# Altium project 1200.PrjPcb
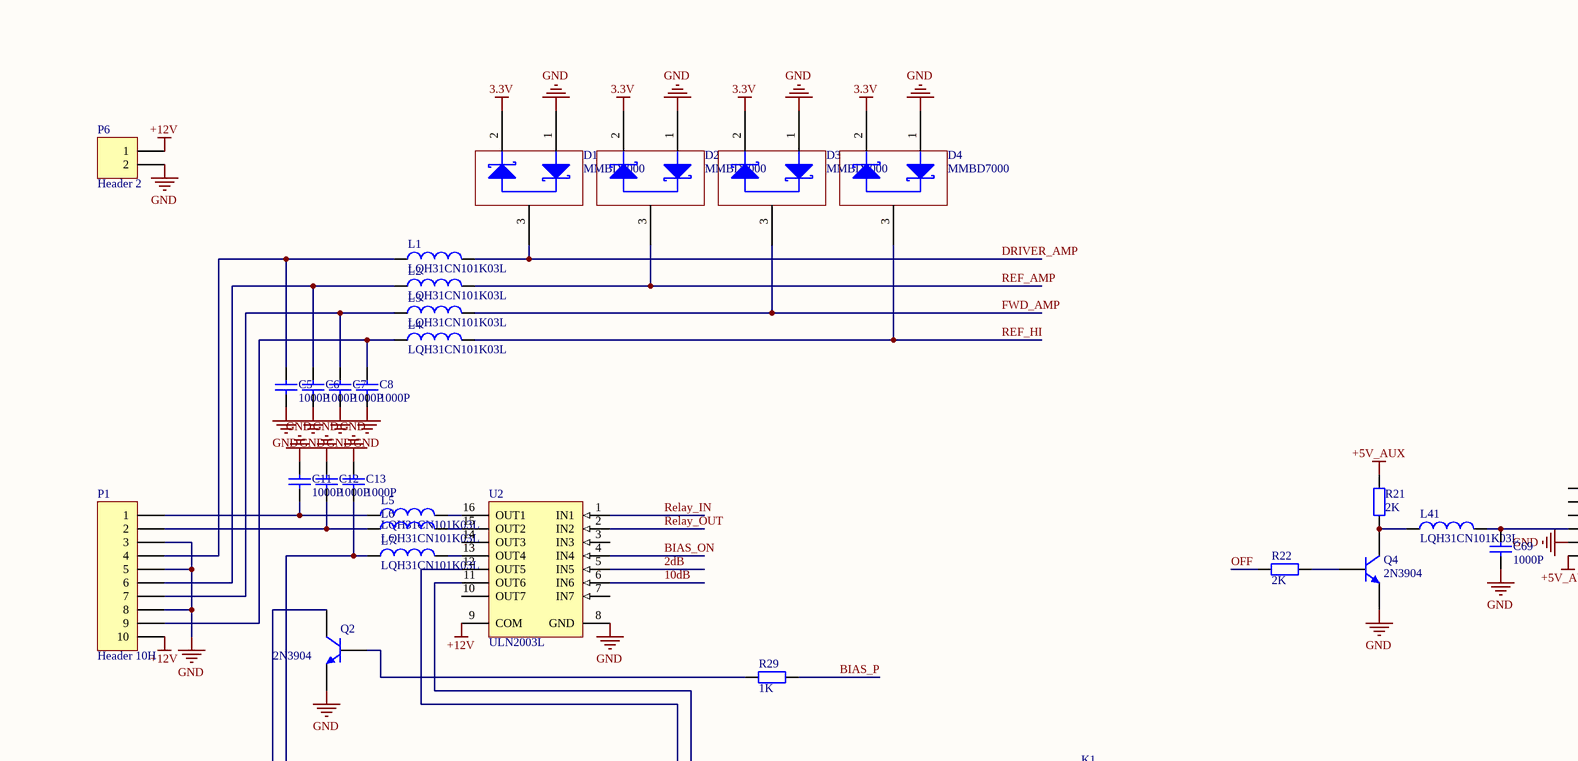
[diagram p0: 1200_cpu.SchDoc, top left]
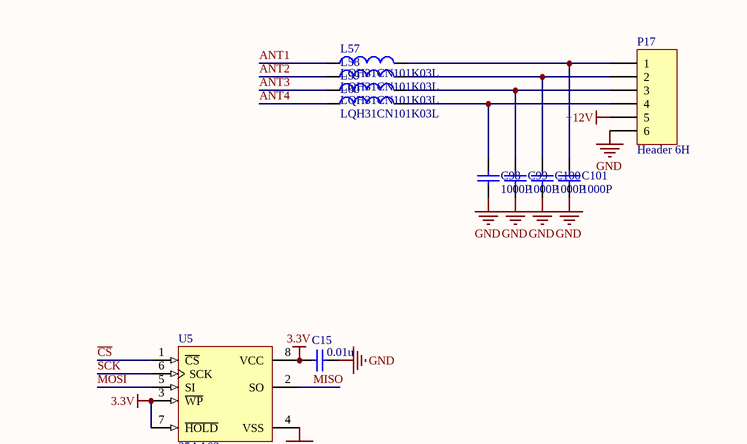
[diagram p1: 1200_cpu.SchDoc, top right]
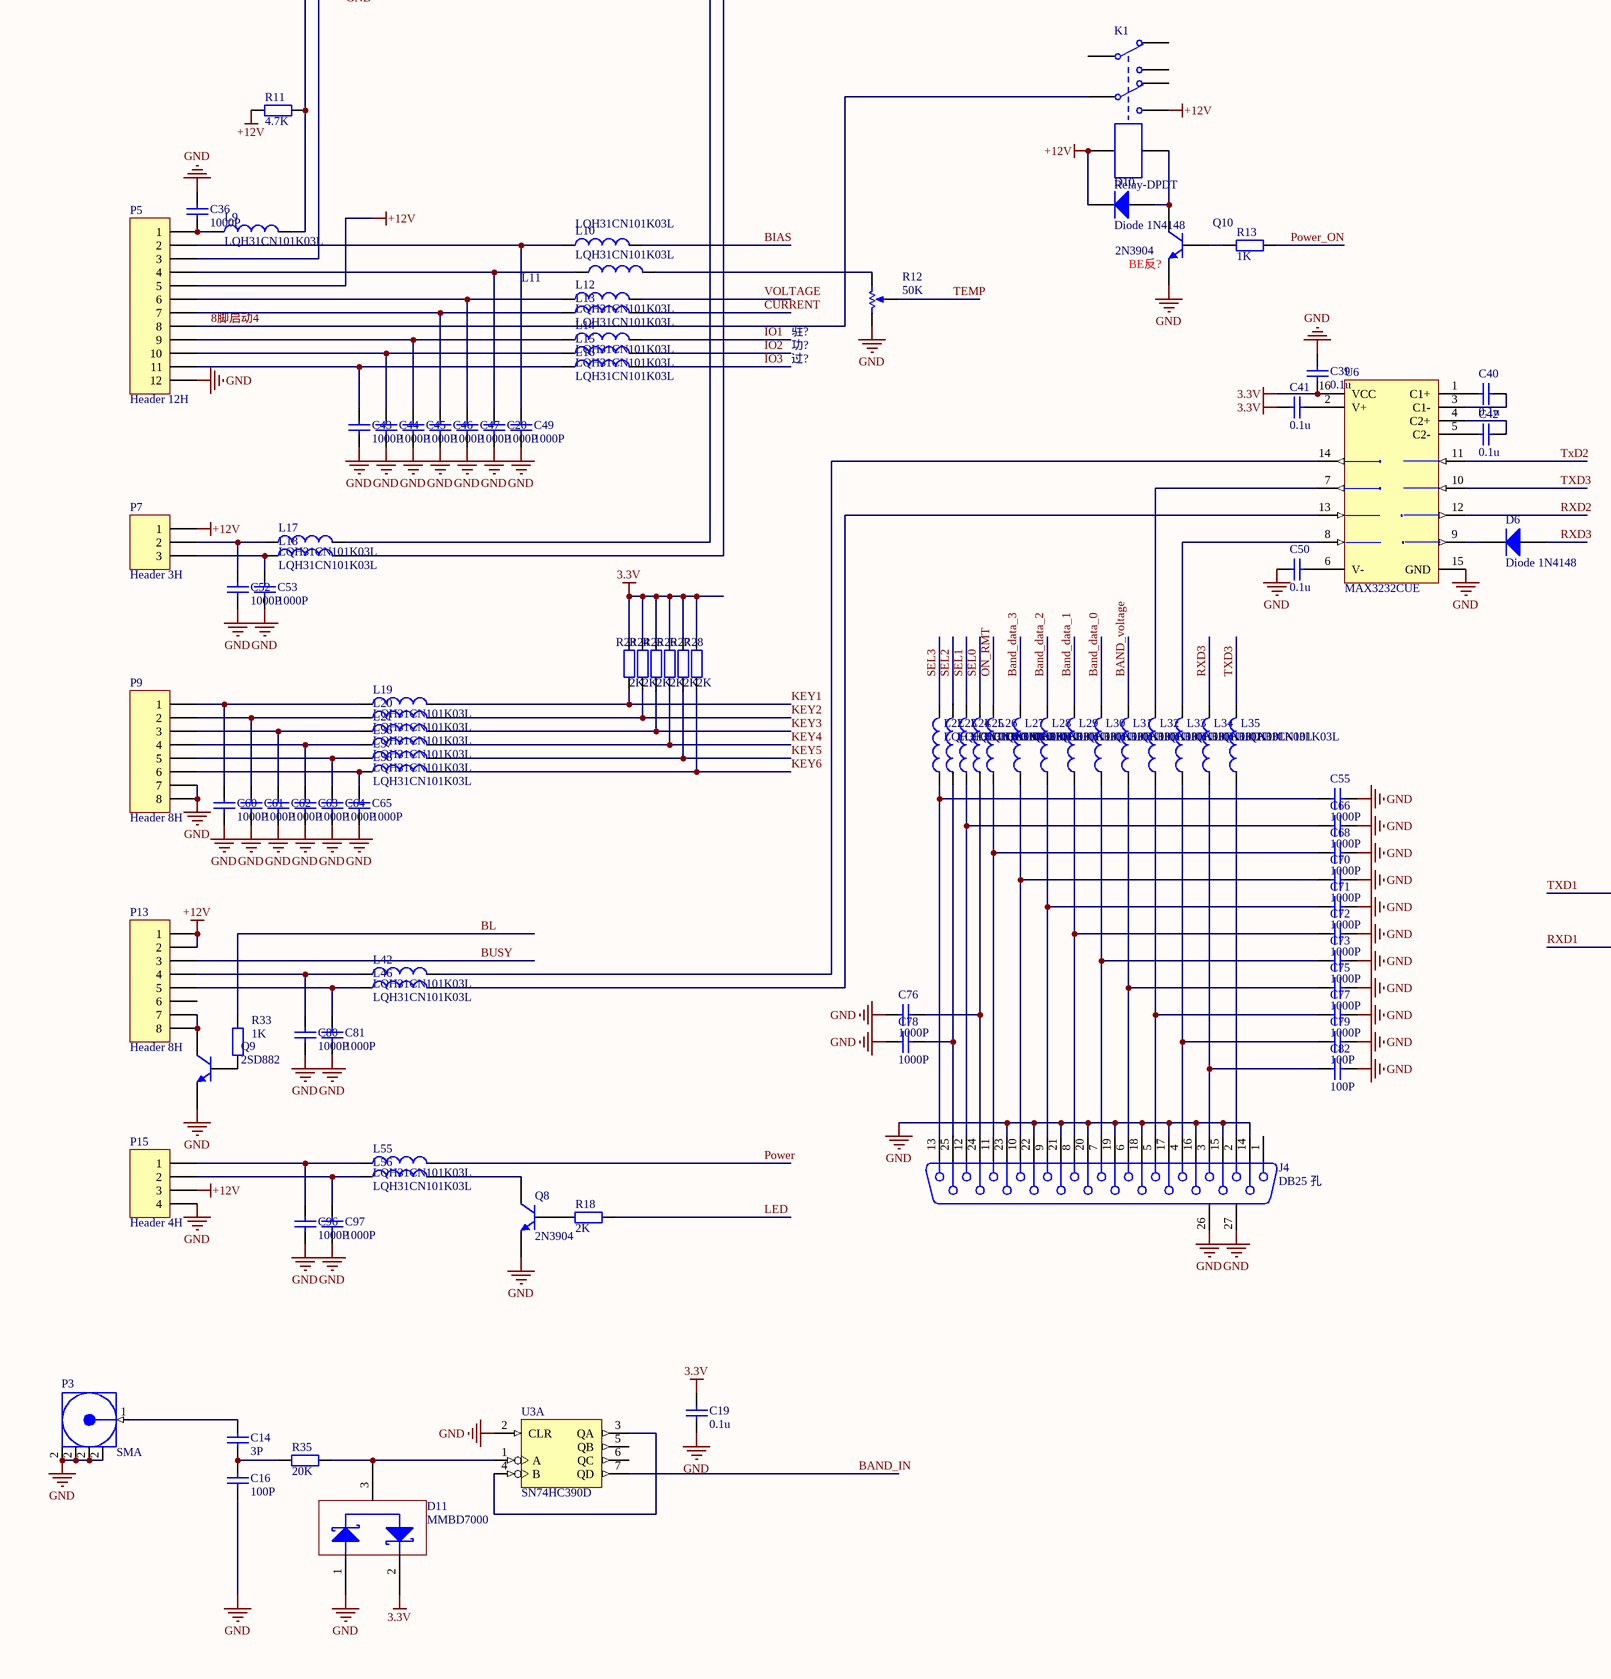
[diagram p2: 1200_cpu.SchDoc, bottom left]
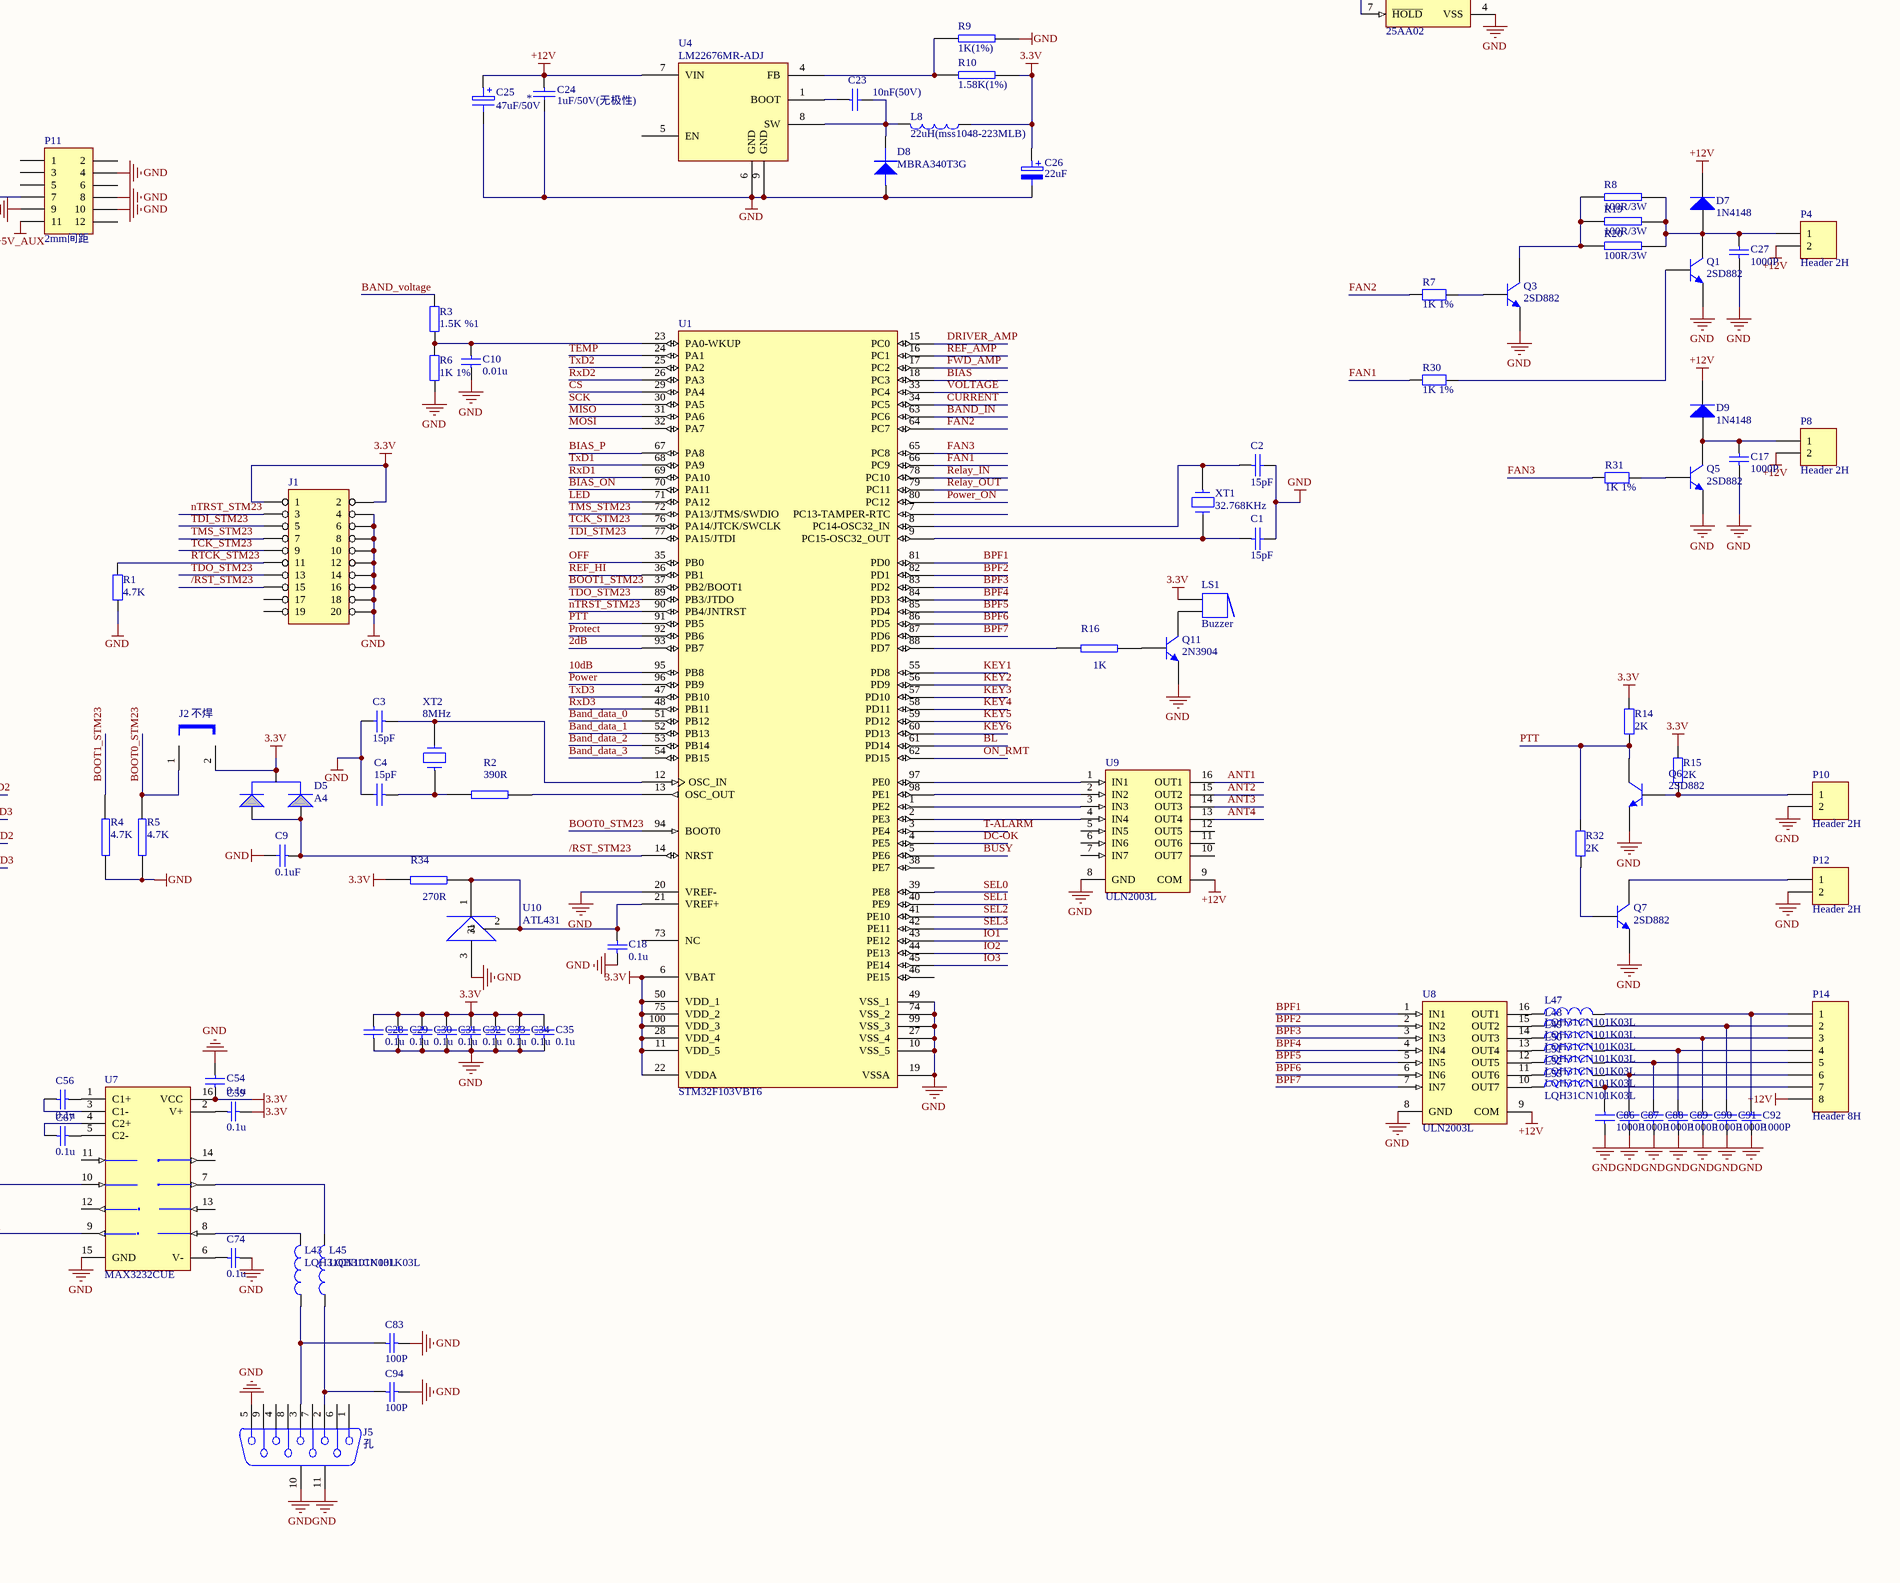
[diagram p3: 1200_cpu.SchDoc, bottom right]
1 sheet, 234 parts. Net scope: global (net labels, ports and power ports of the same name join across sheets).
Board file: 1200_cpu.PcbDoc

## Sheet 1200_cpu.SchDoc
size A1

### Parts
C1  15pF  [C0805-3D]
C2  15pF  [C0805-3D]
C3  15pF  [C0805-3D]
C4  15pF  [C0805-3D]
C5  1000P  [C0805-3D]
C6  1000P  [C0805-3D]
C7  1000P  [C0805-3D]
C8  1000P  [C0805-3D]
C9  0.1uF  [C0805-3D]
C10  0.01u  [C0805-3D]
C11  1000P  [C0805-3D]
C12  1000P  [C0805-3D]
C13  1000P  [C0805-3D]
C14  3P  [C0805-3D]
C15  0.01u  [C0805-3D]
C16  100P  [C0805-3D]
C17  1000P  [C0805-3D]
C18  0.1u  [C0805-3D]
C19  0.1u  [C0805-3D]
C20  1000P  [C0805-3D]
C23  10nF(50V)  [C0805-3D]
C24  *  C: 1uF/50V(无极性)  [1206C]
C25  47uF/50V  [1206c]
C26  22uF  [1206C]
C27  1000P  [C0805-3D]
C28  0.1u  [C0805-3D]
C29  0.1u  [C0805-3D]
C30  0.1u  [C0805-3D]
C31  0.1u  [C0805-3D]
C32  0.1u  [C0805-3D]
C33  0.1u  [C0805-3D]
C34  0.1u  [C0805-3D]
C35  0.1u  [C0805-3D]
C36  1000P  [C0805-3D]
C39  0.1u  [C0805-3D]
C40  0.1u  [C0805-3D]
C41  0.1u  [C0805-3D]
C42  0.1u  [C0805-3D]
C43  1000P  [C0805-3D]
C44  1000P  [C0805-3D]
C45  1000P  [C0805-3D]
C46  1000P  [C0805-3D]
C47  1000P  [C0805-3D]
C49  1000P  [C0805-3D]
C50  0.1u  [C0805-3D]
C52  1000P  [C0805-3D]
C53  1000P  [C0805-3D]
C54  0.1u  [C0805-3D]
C55  1000P  [C0805-3D]
C56  0.1u  [C0805-3D]
C59  0.1u  [C0805-3D]
C60  1000P  [C0805-3D]
C61  1000P  [C0805-3D]
C62  1000P  [C0805-3D]
C63  1000P  [C0805-3D]
C64  1000P  [C0805-3D]
C65  1000P  [C0805-3D]
C66  1000P  [C0805-3D]
C67  0.1u  [C0805-3D]
C68  1000P  [C0805-3D]
C69  1000P  [C0805-3D]
C70  1000P  [C0805-3D]
C71  1000P  [C0805-3D]
C72  1000P  [C0805-3D]
C73  1000P  [C0805-3D]
C74  0.1u  [C0805-3D]
C75  1000P  [C0805-3D]
C76  1000P  [C0805-3D]
C77  1000P  [C0805-3D]
C78  1000P  [C0805-3D]
C79  100P  [C0805-3D]
C80  1000P  [C0805-3D]
C81  1000P  [C0805-3D]
C82  100P  [C0805-3D]
C83  100P  [C0805-3D]
C86  1000P  [C0805-3D]
C87  1000P  [C0805-3D]
C88  1000P  [C0805-3D]
C89  1000P  [C0805-3D]
C90  1000P  [C0805-3D]
C91  1000P  [C0805-3D]
C92  1000P  [C0805-3D]
C94  100P  [C0805-3D]
C96  1000P  [C0805-3D]
C97  1000P  [C0805-3D]
C98  1000P  [C0805-3D]
C99  1000P  [C0805-3D]
C100  1000P  [C0805-3D]
C101  1000P  [C0805-3D]
D1  MMBD7000  [sot-23]
D2  MMBD7000  [sot-23]
D3  MMBD7000  [sot-23]
D4  MMBD7000  [sot-23]
D5  A4  [SOT23]
D6  Diode 1N4148  [do-35]
D7  1N4148  [DO-35]
D8  MBRA340T3G  [1206d]
D9  1N4148  [DO-35]
D10  Diode 1N4148  [do-35]
D11  MMBD7000  [sot-23]
J1  (no value)  [idc20]
J2  不焊  [SIP2]
J4  DB25 孔  [DB25-V]
J5  孔  [DB9-V]
K1  Relay-DPDT  [115f-2z]
L1  LQH31CN101K03L  [1206]
L2  LQH31CN101K03L  [1206]
L3  LQH31CN101K03L  [1206]
L4  LQH31CN101K03L  [1206]
L5  LQH31CN101K03L  [1206]
L6  LQH31CN101K03L  [1206]
L7  LQH31CN101K03L  [1206]
L8  22uH(mss1048-223MLB)  [IND_SMD_10X10]
L9  LQH31CN101K03L  [1206]
L10  LQH31CN101K03L  [1206]
L11  LQH31CN101K03L  [1206]
L12  LQH31CN101K03L  [1206]
L13  LQH31CN101K03L  [1206]
L14  LQH31CN101K03L  [1206]
L15  LQH31CN101K03L  [1206]
L16  LQH31CN101K03L  [1206]
L17  LQH31CN101K03L  [1206]
L18  LQH31CN101K03L  [1206]
L19  LQH31CN101K03L  [1206]
L20  LQH31CN101K03L  [1206]
L21  LQH31CN101K03L  [1206]
L22  LQH31CN101K03L  [1206]
L23  LQH31CN101K03L  [1206]
L24  LQH31CN101K03L  [1206]
L25  LQH31CN101K03L  [1206]
L26  LQH31CN101K03L  [1206]
L27  LQH31CN101K03L  [1206]
L28  LQH31CN101K03L  [1206]
L29  LQH31CN101K03L  [1206]
L30  LQH31CN101K03L  [1206]
L31  LQH31CN101K03L  [1206]
L32  LQH31CN101K03L  [1206]
L33  LQH31CN101K03L  [1206]
L34  LQH31CN101K03L  [1206]
L35  LQH31CN101K03L  [1206]
L36  LQH31CN101K03L  [1206]
L37  LQH31CN101K03L  [1206]
L38  LQH31CN101K03L  [1206]
L41  LQH31CN101K03L  [1206]
L42  LQH31CN101K03L  [1206]
L43  LQH31CN101K03L  [1206]
L45  LQH31CN101K03L  [1206]
L46  LQH31CN101K03L  [1206]
L47  LQH31CN101K03L  [1206]
L48  LQH31CN101K03L  [1206]
L49  LQH31CN101K03L  [1206]
L50  LQH31CN101K03L  [1206]
L51  LQH31CN101K03L  [1206]
L52  LQH31CN101K03L  [1206]
L53  LQH31CN101K03L  [1206]
L55  LQH31CN101K03L  [1206]
L56  LQH31CN101K03L  [1206]
L57  LQH31CN101K03L  [1206]
L58  LQH31CN101K03L  [1206]
L59  LQH31CN101K03L  [1206]
L60  LQH31CN101K03L  [1206]
LS1  Buzzer  [BEEP]
P1  Header 10H  [2510-10]
P3  SMA  [sma]
P4  Header 2H  [2510-2]
P5  Header 12H  [2510-12]
P6  Header 2  [3.96-2]
P7  Header 3H  [2510-3]
P8  Header 2H  [2510-2]
P9  Header 8H  [2510-8]
P10  Header 2H  [2510-2]
P11  2mm间距  [2x6(2mm)]
P12  Header 2H  [2510-2]
P13  Header 8H  [2510-8]
P14  Header 8H  [2510-8]
P15  Header 4H  [2510-4]
P17  Header 6H  [2510-6]
Q1  2SD882  [TO229P1010X238-3N]
Q2  2N3904  [sot-23]
Q3  2SD882  [TO229P1010X238-3N]
Q4  2N3904  [sot-23]
Q5  2SD882  [TO229P1010X238-3N]
Q6  2SD882  [TO229P1010X238-3N]
Q7  2SD882  [TO229P1010X238-3N]
Q8  2N3904  [sot-23]
Q9  2SD882  [TO229P1010X238-3N]
Q10  2N3904  [sot-23]
Q11  2N3904  [sot-23]
R1  4.7K  [R0805-P3D]
R2  390R  [R0805-P3D]
R3  1.5K %1  [R0805-P3D]
R4  4.7K  [R0805-P3D]
R5  4.7K  [R0805-P3D]
R6  1K 1%  [R0805-P3D]
R7  1K 1%  [R0805-P3D]
R8  100R/3W  [axial0.8]
R9  1K(1%)  [R0805-P3D]
R10  1.58K(1%)  [R0805-P3D]
R11  4.7K  [R0805-P3D]
R12  50K  [3296]
R13  1K  [R0805-P3D]
R14  2K  [R0805-P3D]
R15  2K  [R0805-P3D]
R16  1K  [R0805-P3D]
R18  2K  [R0805-P3D]
R19  100R/3W  [axial0.8]
R20  100R/3W  [axial0.8]
R21  2K  [R0805-P3D]
R22  2K  [R0805-P3D]
R23  2K  [R0805-P3D]
R24  2K  [R0805-P3D]
R25  2K  [R0805-P3D]
R26  2K  [R0805-P3D]
R27  2K  [R0805-P3D]
R28  2K  [R0805-P3D]
R29  1K  [R0805-P3D]
R30  1K 1%  [R0805-P3D]
R31  1K 1%  [R0805-P3D]
R32  2K  [R0805-P3D]
R33  1K  [R0805-P3D]
R34  270R  [R0805-P3D]
R35  20K  [R0805-P3D]
U1  STM32F103VBT6  [LQFP100_N]
U2  ULN2003L  [SO-16]
U3  SN74HC390D  [D016_N]  (part A of 2)
U4  LM22676MR-ADJ  [PSOP-8]
U5  25AA02  [SOP-8]
U6  MAX3232CUE  [so-16]
U7  MAX3232CUE  [so-16]
U8  ULN2003L  [SO-16]
U9  ULN2003L  [SO-16]
U10  ATL431  [sot23]
XT1  32.768KHz  [XTAL3]
XT2  8MHz  [XTAL]

### Nets
3.3V: C15.1 C19.1 C26.1 C28.1 C29.1 C30.1 C31.1 C32.1 C33.1 C34.1 C35.1 C39.2 C41.2 C54.2 C59.2 D1.2 D2.2 D3.2 D4.2 D5.2(K) D11.2 J1.1 J1.2 J2.2 L8.1 LS1.1 R10.1 R14.2 R15.2 R23.2 R24.2 R25.2 R26.2 R27.2 R28.2 R34.1 U1.6(VBAT) U1.11(VDD_5) U1.22(VDDA) U1.28(VDD_4) U1.50(VDD_1) U1.75(VDD_2) U1.100(VDD_3) U5.3(~{WP}) U5.7(~{HOLD}) U5.8(VCC) U6.16(VCC) U7.16(VCC)
+5V_AUX: P11.11 R21.1
+12V: C24.1 C25.1 D7.2(K) D9.2(K) D10.2(K) K1.6 K1.7 P1.10 P4.2 P5.5 P6.1 P7.1 P8.2 P13.1 P13.2 P14.8 P15.3 P17.5 R11.1 U2.9(COM) U4.7(VIN) U8.9(COM) U9.9(COM)
GND: C1.2 C2.2 C3.2 C4.2 C5.1 C6.1 C7.1 C8.1 C9.2 C10.2 C11.2 C12.2 C13.2 C15.2 C16.2 C17.1 C18.2 C19.2 C20.1 C24.2 C25.2 C26.2 C27.1 C28.2 C29.2 C30.2 C31.2 C32.2 C33.2 C34.2 C35.2 C36.2 C39.1 C43.1 C44.1 C45.1 C46.1 C47.1 C49.1 C50.1 C52.1 C53.1 C54.1 C55.1 C60.1 C61.1 C62.1 C63.1 C64.1 C65.1 C66.1 C68.1 C69.1 C70.1 C71.1 C72.1 C73.1 C74.1 C75.1 C76.2 C77.1 C78.2 C79.1 C80.1 C81.1 C82.1 C83.1 C86.1 C87.1 C88.1 C89.1 C90.1 C91.1 C92.1 C94.1 C96.1 C97.1 C98.1 C99.1 C100.1 C101.1 D1.1 D2.1 D3.1 D4.1 D8.A D11.1 J1.4 J1.6 J1.8 J1.10 J1.12 J1.14 J1.16 J1.18 J1.20 J4.14 J4.15 J4.16 J4.17 J4.18 J4.19 J4.20 J4.21 J4.22 J4.23 J4.26(MH1) J4.27(MH2) J5.5 J5.10(MH1) J5.11(MH2) P1.3 P1.5 P1.8 P3.2(GND) P5.12 P6.2 P9.7 P9.8 P10.2 P11.4 P11.8 P11.9 P11.10 P12.2 P15.4 P17.6 Q1.3(E) Q2.2(E) Q3.3(E) Q4.2(E) Q5.3(E) Q6.3(E) Q7.3(E) Q8.2(E) Q9.3(E) Q10.2(E) Q11.2(E) R1.1 R4.2 R5.2 R6.1 R9.1 R12.2(BOT) U1.10(VSS_5) U1.19(VSSA) U1.20(VREF-) U1.27(VSS_4) U1.49(VSS_1) U1.74(VSS_2) U1.99(VSS_3) U2.8(GND) U3.2(CLR) U3.8(GND) U4.6(GND) U4.9(GND) U5.4(VSS) U6.15(GND) U7.15(GND) U8.8(GND) U9.8(GND) U10.3
VCC: U3.16(VCC)
2dB: U1.93(PB7) U2.5(IN5)
8脚启动4: K1.4 P5.8
10dB: U1.95(PB8) U2.6(IN6)
/RST_STM23: C9.1 D5.1(A1) D5.3(A2) J1.15 U1.14(NRST)
ANT1: L57.2 U9.16(OUT1)
ANT2: L58.2 U9.15(OUT2)
ANT3: L59.2 U9.14(OUT3)
ANT4: L60.2 U9.13(OUT4)
Band_data_0: L30.2 U1.51(PB12)
Band_data_1: L29.2 U1.52(PB13)
Band_data_2: L28.2 U1.53(PB14)
Band_data_3: L27.2 U1.54(PB15)
BAND_IN: U1.63(PC6) U3.7(QD)
BAND_voltage: L31.2 R3.2
BIAS: L10.2 U1.18(PC3)
BIAS_ON: U1.70(PA11) U2.4(IN4)
BIAS_P: R29.1 U1.67(PA8)
BL: R33.1 U1.61(PD14)
BOOT0_STM23: J2.1 R5.1 U1.94(BOOT0)
BOOT1_STM23: R4.1 U1.37(PB2/BOOT1)
BPF1: U1.81(PD0) U8.1(IN1)
BPF2: U1.82(PD1) U8.2(IN2)
BPF3: U1.83(PD2) U8.3(IN3)
BPF4: U1.84(PD3) U8.4(IN4)
BPF5: U1.85(PD4) U8.5(IN5)
BPF6: U1.86(PD5) U8.6(IN6)
BPF7: U1.87(PD6) U8.7(IN7)
BUSY: P13.3 U1.5(PE6)
~{CS}: U1.29(PA4) U5.1(~{CS})
CURRENT: L13.2 U1.34(PC5)
DC-OK: U1.4(PE5)
DRIVER_AMP: D1.3 L1.2 U1.15(PC0)
FAN1: R30.2 U1.66(PC9)
FAN2: R7.2 U1.64(PC7)
FAN3: R31.2 U1.65(PC8)
FWD_AMP: D3.3 L3.2 U1.17(PC2)
IO1: L14.2 U1.43(PE12)
IO2: L15.2 U1.44(PE13)
IO3: L16.2 U1.45(PE14)
KEY1: L19.2 R23.1 U1.55(PD8)
KEY2: L20.2 R24.1 U1.56(PD9)
KEY3: L21.2 R25.1 U1.57(PD10)
KEY4: L36.2 R26.1 U1.58(PD11)
KEY5: L37.2 R27.1 U1.59(PD12)
KEY6: L38.2 R28.1 U1.60(PD13)
LED: R18.2 U1.71(PA12)
MISO: U1.31(PA6) U5.2(SO)
MOSI: U1.32(PA7) U5.5(SI)
nTRST_STM23: J1.3 U1.90(PB4/JNTRST)
OFF: R22.2 U1.35(PB0)
ON_RMT: L26.2 U1.62(PD15)
Power: L55.2 U1.96(PB9)
Power_ON: R13.1 U1.80(PC12)
Protect: U1.92(PB6)
PTT: Q6.2(C) R14.1 R32.2 U1.91(PB5)
REF_AMP: D2.3 L2.2 U1.16(PC1)
REF_HI: D4.3 L4.2 U1.36(PB1)
Relay_IN: U1.78(PC10) U2.1(IN1)
Relay_OUT: U1.79(PC11) U2.2(IN2)
RTCK_STM23: J1.11 R1.2
RXD1: U1.69(PA10) U7.9(R2OUT)
RXD2: U1.26(PA3) U6.12(R1OUT)
RXD3: D6.1(A) L34.2 U1.48(PB11)
SCK: U1.30(PA5) U5.6(SCK)
SEL0: L25.2 U1.39(PE8)
SEL1: L24.2 U1.40(PE9)
SEL2: L23.2 U1.41(PE10)
SEL3: L22.2 U1.42(PE11)
T-ALARM: U1.3(PE4)
TCK_STM23: J1.9 U1.76(PA14/JTCK/SWCLK)
TDI_STM23: J1.5 U1.77(PA15/JTDI)
TDO_STM23: J1.13 U1.89(PB3/JTDO)
TEMP: R12.3(TAP) U1.24(PA1)
TMS_STM23: J1.7 U1.72(PA13/JTMS/SWDIO)
TXD1: U1.68(PA9) U7.10(T2IN)
TxD2: U1.25(PA2) U6.11(T1IN)
TXD3: L35.2 U1.47(PB10) U6.10(T2IN)
VOLTAGE: L12.2 U1.33(PC4)
NetC1_1: C1.1 U1.9(PC15-OSC32_OUT) XT1.2
NetC2_1: C2.1 U1.8(PC14-OSC32_IN) XT1.1
NetC3_1: C3.1 U1.12(OSC_IN) XT2.2
NetC4_1: C4.1 R2.1 XT2.1
NetC5_2: C5.2 L1.1 P1.4
NetC6_2: C6.2 L2.1 P1.6
NetC7_2: C7.2 L3.1 P1.7
NetC8_2: C8.2 L4.1 P1.9
NetC10_1: C10.1 R3.1 R6.2 U1.23(PA0-WKUP)
NetC11_1: C11.1 L5.1 P1.1
NetC12_1: C12.1 L6.1 P1.2
NetC13_1: C13.1 L7.1 P5.3
NetC14_1: C14.1 P3.1(Signal)
NetC14_2: C14.2 C16.1 R35.1
NetC17_2: C17.2 D9.1(A) P8.1 Q5.2(C)
NetC18_1: C18.1 R34.2 U1.21(VREF+) U10.1 U10.2
NetC20_2: C20.2 L11.1 P5.4
NetC23_1: C23.1 U4.1(BOOT)
NetC23_2: C23.2 D8.K L8.2 U4.8(SW)
NetC27_2: C27.2 D7.1(A) P4.1 Q1.2(C) R8.1 R19.1 R20.1
NetC36_1: C36.1 L9.1 P5.1
NetC40_1: C40.1 U6.3(C1-)
NetC40_2: C40.2 U6.1(C1+)
NetC41_1: C41.1 U6.2(V+)
NetC42_1: C42.1 U6.5(C2-)
NetC42_2: C42.2 U6.4(C2+)
NetC43_2: C43.2 L16.1 P5.11
NetC44_2: C44.2 L15.1 P5.10
NetC45_2: C45.2 L14.1 P5.9
NetC46_2: C46.2 L13.1 P5.7
NetC47_2: C47.2 L12.1 P5.6
NetC49_2: C49.2 L10.1 P5.2
NetC50_2: C50.2 U6.6(V-)
NetC52_2: C52.2 L17.1 P7.2
NetC53_2: C53.2 L18.1 P7.3
NetC55_2: C55.2 J4.13 L22.1
NetC56_1: C56.1 U7.3(C1-)
NetC56_2: C56.2 U7.1(C1+)
NetC59_1: C59.1 U7.2(V+)
NetC60_2: C60.2 L19.1 P9.1
NetC61_2: C61.2 L20.1 P9.2
NetC62_2: C62.2 L21.1 P9.3
NetC63_2: C63.2 L36.1 P9.4
NetC64_2: C64.2 L37.1 P9.5
NetC65_2: C65.2 L38.1 P9.6
NetC66_2: C66.2 J4.12 L24.1
NetC67_1: C67.1 U7.5(C2-)
NetC67_2: C67.2 U7.4(C2+)
NetC68_2: C68.2 J4.11 L26.1
NetC69_2: C69.2 L41.1 P11.7
NetC70_2: C70.2 J4.10 L27.1
NetC71_2: C71.2 J4.9 L28.1
NetC72_2: C72.2 J4.8 L29.1
NetC73_2: C73.2 J4.7 L30.1
NetC74_2: C74.2 U7.6(V-)
NetC75_2: C75.2 J4.6 L31.1
NetC76_1: C76.1 J4.24 L25.1
NetC77_2: C77.2 J4.5 L32.1
NetC78_1: C78.1 J4.25 L23.1
NetC79_2: C79.2 J4.4 L33.1
NetC80_2: C80.2 L42.1 P13.4
NetC81_2: C81.2 L46.1 P13.5
NetC82_2: C82.2 J4.3 L34.1
NetC83_2: C83.2 J5.3 L43.2
NetC86_2: C86.2 L53.1 P14.7
NetC87_2: C87.2 L52.1 P14.6
NetC88_2: C88.2 L51.1 P14.5
NetC89_2: C89.2 L50.1 P14.4
NetC90_2: C90.2 L49.1 P14.3
NetC91_2: C91.2 L48.1 P14.2
NetC92_2: C92.2 L47.1 P14.1
NetC94_2: C94.2 J5.2 L45.2
NetC96_2: C96.2 L55.1 P15.1
NetC97_2: C97.2 L56.1 P15.2
NetC98_2: C98.2 L60.1 P17.4
NetC99_2: C99.2 L59.1 P17.3
NetC100_2: C100.2 L58.1 P17.2
NetC101_2: C101.2 L57.1 P17.1
NetD6_2: D6.2(K) U6.9(R2OUT)
NetD10_1: D10.1(A) K1.8 Q10.3(C)
NetD11_3: D11.3 R35.2 U3.1(A)
NetJ4_2: J4.2 L35.1
NetL5_2: L5.2 U2.16(OUT1)
NetL6_2: L6.2 U2.15(OUT2)
NetL7_2: L7.2 U2.13(OUT4)
NetL9_2: L9.2 Q2.3(C) R11.2
NetL11_2: L11.2 R12.1(TOP)
NetL17_2: L17.2 U2.12(OUT5)
NetL18_2: L18.2 U2.11(OUT6)
NetL32_2: L32.2 U6.7(T2OUT)
NetL33_2: L33.2 U6.8(R2IN)
NetL41_2: L41.2 Q4.3(C) R21.2
NetL42_2: L42.2 U6.14(T1OUT)
NetL43_1: L43.1 U7.8(R2IN)
NetL45_1: L45.1 U7.7(T2OUT)
NetL46_2: L46.2 U6.13(R1IN)
NetL47_2: L47.2 U8.16(OUT1)
NetL48_2: L48.2 U8.15(OUT2)
NetL49_2: L49.2 U8.14(OUT3)
NetL50_2: L50.2 U8.13(OUT4)
NetL51_2: L51.2 U8.12(OUT5)
NetL52_2: L52.2 U8.11(OUT6)
NetL53_2: L53.2 U8.10(OUT7)
NetL56_2: L56.2 Q8.3(C)
NetLS1_2: LS1.2 Q11.3(C)
NetP10_1: P10.1 Q6.1(B) R15.1
NetP12_1: P12.1 Q7.2(C)
NetP13_7: P13.7 P13.8 Q9.2(C)
NetQ1_1: Q1.1(B) R30.1
NetQ2_1: Q2.1(B) R29.2
NetQ3_1: Q3.1(B) R7.1
NetQ3_2: Q3.2(C) R8.2 R19.2 R20.2
NetQ4_1: Q4.1(B) R22.1
NetQ5_1: Q5.1(B) R31.1
NetQ7_1: Q7.1(B) R32.1
NetQ8_1: Q8.1(B) R18.1
NetQ9_1: Q9.1(B) R33.2
NetQ10_1: Q10.1(B) R13.2
NetQ11_1: Q11.1(B) R16.2
NetR2_2: R2.2 U1.13(OSC_OUT)
NetR9_2: R9.2 R10.2 U4.4(FB)
NetR16_1: R16.1 U1.88(PD7)
NetU1_1: U1.1(PE2) U9.3(IN3)
NetU1_2: U1.2(PE3) U9.4(IN4)
NetU1_97: U1.97(PE0) U9.1(IN1)
NetU1_98: U1.98(PE1) U9.2(IN2)
NetU3_3: U3.3(QA) U3.4(B)

Not connected (* = marked no-connect by the designer): J1 17 19; J4 1; J5 1 4 6 7 8 9; K1 1 2 3 5; P11 1 2 3 5 6 12; P13 6; U1 7(PC13-TAMPER-RTC) 38(PE7) 46(PE15) 73(NC); U2 3(IN3) 7(IN7) 10(OUT7) 14(OUT3); U3 5(QB) 6(QC); U4 5(EN); U7 11(T1IN) 12(R1OUT) 13(R1IN) 14(T1OUT); U9 5(IN5) 6(IN6) 7(IN7) 10(OUT7) 11(OUT6) 12(OUT5)

### Notes on the sheet
- (near Q10) BE反?
- 驻?
- 功?
- 过?

### Library data of the parts
C1-C4 C9 C23 = CAP: Capacitor
C5-C8 C10-C20 C27-C36 C39-C47 C49 C50 C52-C56 C59-C83 C86-C92 C94 C96-C101 = Cap: Capacitor; Value: 100pF; Published: 8-Jun-2000; LatestRevisionDate: 17-Jul-2002; LatestRevisionNote: Re-released for DXP Platform.; PackageReference: RAD-0.3; Publisher: Altium Limited; PackageDescription: Radial Cap, Thru-Hole; 2 Leads; 0.3 in Pin Spacing
C24 = CAP
C25 = ELECTRO1
C26 = ELECTRO2: Electrolytic Capacitor; Part Field 1: 8-Jun-2000; Part Field 2: 17-Jul-2002; Part Field 3: Re-released for DXP Platform.; Part Field 4: RAD-0.3; Part Field 5: Altium Limited; Part Field 6: 100pF
D1-D4 D11 = BAT54S
D6 D7 D9 D10 = Diode 1N4148: High Conductance Fast Diode; Published: 8-Jun-2000; LatestRevisionDate: 17-Jul-2002; LatestRevisionNote: Re-released for DXP Platform.; DatasheetVersion: 1997; PackageReference: DO-35; Publisher: Altium Limited; PackageDescription: Diode, Axial; Body 3.8 x 1.9 mm (LxDia. max), Lead Dia. 0.53 mm (max); Code_JEDEC: DO-204-AH; ComponentLink1Description: Manufacturer Link; ComponentLink1URL: http://www.fairchildsemi.com/; ComponentLink2Description: Datasheet; ComponentLink2URL: http://www.fairchildsemi.com/ds/1N%2F1N4148.pdf
D8 = DIODE
J1 = HEADER 10X2
J2 = JUMPER
J4 = D Connector 25: Receptacle Assembly, 25 Position, Right Angle; PackageDocument: U; Positions: 25; Published: 15-Jun-2001; LatestRevisionDate: 17-Jul-2002; LatestRevisionNote: Re-released for DXP Platform.; DatasheetDocument: 19-Mar-1999; PackageReference: 787202; Publisher: Altium Limited; Orientation: Right Angle; Gender: Receptacle
J5 = D Connector 9: Receptacle Assembly, 9 Position, Right Angle; PackageDocument: O; Positions: 9; Published: 15-Jun-2001; LatestRevisionDate: 17-Jul-2002; LatestRevisionNote: Re-released for DXP Platform.; DatasheetDocument: 1-Sep-1999; PackageReference: 788750; Publisher: Altium Limited; Orientation: Right Angle; Gender: Receptacle
K1 = Relay-DPDT: Dual-Pole Dual-Throw Relay; Published: 24-Mar-1999; LatestRevisionDate: 17-Jul-2002; LatestRevisionNote: Re-released for DXP Platform.; PackageReference: DIP-P8; Publisher: Altium Limited; PackageDescription: Relay; 8 Leads
L1-L7 L9-L38 L41-L43 L45-L53 L55-L60 = Inductor: Code_IEC: 1005; Value: 10mH; Published: 8-Jun-2000; LatestRevisionDate: 29-May-2009; LatestRevisionNote: IPC-7351 Footprint Added.; PackageReference: 0402-A; Publisher: Altium Limited; PackageDescription: Chip Inductor; Code_JEITA: 0402
L8 = INDUCTOR1
LS1 = Buzzer: Magnetic Transducer Buzzer; Published: 24-Mar-1999; LatestRevisionDate: 17-Dec-2003; LatestRevisionNote: Schematic revised, PCB Footprint replaced.; DatasheetVersion: 17-Dec-2003; PackageReference: ABSM-1574; Publisher: Altium Limited; PackageDescription: Magnetic Transducer Buzzer; ComponentLink1Description: Manufacturer Link; ComponentLink1URL: http://www.megastar.com/linecard/buzzmode/index.php
P1 = Header 10H: Header, 10-Pin, Right Angle; LatestRevisionDate: 17-Jul-2002; LatestRevisionNote: Re-released for DXP Platform.; Publisher: Altium Limited
P3 = COAX-M: RF Coaxial PCB Connector, MMCX; Thru-Hole, Vertical Mount Plug,  50 Ohm Impedance; PackageDocument: Rev. A, 16-Jun-1997; PCB_Layout: Complies with manufacturer's recommendation.; DrillSize: Corresponds to nominal value.; Published: 15-Jul-2004; LatestRevisionDate: 15-Jul-2004; LatestRevisionNote: Component Replaced.; DatasheetDocument: 30-May-2003; PackageReference: 908-21103; Publisher: Altium Limited; ComponentLink1Description: Manufacturer Link; ComponentLink1URL: http://www.amphenolrf.com/
P4 P8 P10 P12 = Header 2H: Header, 2-Pin, Right Angle; LatestRevisionDate: 17-Jul-2002; LatestRevisionNote: Re-released for DXP Platform.; Publisher: Altium Limited
P5 = Header 12H: Header, 12-Pin, Right Angle; LatestRevisionDate: 17-Jul-2002; LatestRevisionNote: Re-released for DXP Platform.; Publisher: Altium Limited
P6 = Header 2: Header, 2-Pin; LatestRevisionDate: 17-Jul-2002; LatestRevisionNote: Re-released for DXP Platform.; Publisher: Altium Limited
P7 = Header 3H: Header, 3-Pin, Right Angle; LatestRevisionDate: 17-Jul-2002; LatestRevisionNote: Re-released for DXP Platform.; Publisher: Altium Limited
P9 P13 P14 = Header 8H: Header, 8-Pin, Right Angle; LatestRevisionDate: 17-Jul-2002; LatestRevisionNote: Re-released for DXP Platform.; Publisher: Altium Limited
P11 = Header 6X2: Header, 6-Pin, Dual row; LatestRevisionDate: 17-Jul-2002; LatestRevisionNote: Re-released for DXP Platform.; Publisher: Altium Limited
P15 = Header 4H: Header, 4-Pin, Right Angle; LatestRevisionDate: 17-Jul-2002; LatestRevisionNote: Re-released for DXP Platform.; Publisher: Altium Limited
P17 = Header 6H: Header, 6-Pin, Right Angle; LatestRevisionDate: 17-Jul-2002; LatestRevisionNote: Re-released for DXP Platform.; Publisher: Altium Limited
Q1-Q7 Q9-Q11 = 2N3904: NPN General Purpose Amplifier; Published: 8-Jun-2000; LatestRevisionDate: 15-Jan-2003; LatestRevisionNote: PCB Footprint 'BCY-W3/D4.7' replaced; DatasheetVersion: 1997; PackageVersion: Sep-1998; PackageReference: TO-92A; Publisher: Altium Limited; PackageDescription: TO, Flat Index; 3 In-Line, Axial Leads; Body Dia. 4.5mm; Leads 0.51 x 0.48 mm (max); ComponentLink1Description: Manufacturer Link; ComponentLink1URL: http://www.fairchildsemi.com/; ComponentLink2Description: Datasheet; ComponentLink2URL: http://www.fairchildsemi.com/ds/2N%2F2N3904.pdf
Q8 = NPN: NPN Bipolar Transistor; Published: 8-Jun-2000; LatestRevisionDate: 17-Jul-2002; LatestRevisionNote: Re-released for DXP Platform.; PackageReference: TO-226-AA; Publisher: Altium Limited; PackageDescription: TO, Flat Index; 3 In-Line, Axial Leads; Body Dia. 4.8mm; Leads 0.55 x 0.51 mm (max); Code_JEDEC: TO-226-AA
R1 = Res2: Resistor; Manufacturer: Generic Components; Class: Passive; Published: 08/06/2000; Publisher: Altium Hobart Technology Centre; SubClass: Resistor; Value: 4.7K
R2 R4 R5 R8-R10 R16 R19 R20 R34 = RES2
R3 R11 R14 R15 R18 R21-R28 R32 R35 = Res2: Resistor; Value: 1K; Published: 8-Jun-2000; LatestRevisionDate: 17-Jul-2002; LatestRevisionNote: Re-released for DXP Platform.; PackageReference: AXIAL-0.4; Publisher: Altium Limited; PackageDescription: Axial Device, Thru-Hole; 2 Leads; 0.4 in Pin Spacing
R6 R7 R13 R29-R31 R33 = Res2: Resistor; Published: 8-Jun-2000; LatestRevisionDate: 17-Jul-2002; LatestRevisionNote: Re-released for DXP Platform.; PackageReference: AXIAL-0.4; Publisher: Altium Limited; PackageDescription: Axial Device, Thru-Hole; 2 Leads; 0.4 in Pin Spacing; Value: 1K
R12 = RPot: Potentiometer; Sim Note: Enter the Resistance value and the set point into parameter fields.; Set Position: 0.5; Value: 1K; Published: 8-Jun-2000; LatestRevisionDate: 17-Jul-2002; LatestRevisionNote: Re-released for DXP Platform.; PackageReference: VR5; Publisher: Altium Limited; PackageDescription: Variable Resistor, Thru-Hole; 3 Leads
U1 = STM32F103VBT6: STM32 ARM-based 32-bit MCU with 64 Kbytes Flash, 100-pin LQFP, Industrial Temperature; Published: 30-May-2008; DatasheetVersion: rev6, Mar-2008; PackageVersion: Mar-2008; PackageReference: LQFP100; Publisher: Altium Limited; PackageDescription: 100-Pin Low-Profile Quad Flat Pack, 14 x 14 mm Body, 0.5 mm Pitch (LQFP100); ComponentLink1Description: Manufacturer Link; ComponentLink1URL: www.st.com/stm32; ComponentLink2Description: Datasheet; ComponentLink2URL: http://www.st.com/stonline/products/literature/ds/13587.pdf
U2 U8 U9 = ULN2003L: High-Voltage, High-Current Darlington Array; Published: 13-Oct-2000; LatestRevisionDate: 13-Apr-2006; LatestRevisionNote: IPC-7351 Footprint Added.; DatasheetVersion: 1998; PackageReference: L16; Publisher: Altium Limited; PackageDescription: 16-Pin Small Outline Integrated Circuit 1.27 mm Pitch; Code_JEDEC: MS-012-AC; Code_IPC: SOIC127P600-16; ComponentLink1Description: Manufacturer Link; ComponentLink1URL: http://www.allegromicro.com/
U3 = SN74HC390D: Dual 4-Bit Decade and Binary Counter; Published: 8-Jun-2000; LatestRevisionDate: 13-Apr-2006; LatestRevisionNote: IPC-7351 Footprint Added.; DatasheetVersion: Jun-1989; PackageVersion: Jan-1998; PackageReference: D016; Publisher: Altium Limited; PackageDescription: 16-Pin Small Outline Integrated Circuit 1.27 mm Pitch; Code_IPC: SOIC127P600-16; ComponentLink1Description: Manufacturer Link; ComponentLink1URL: http://www.ti.com/
U5 = 25AA02E48-I/SN: 2K SPI Bus Serial EEPROM with EUI-48 Node Identity, 8-Pin SOIC, Industrial Temperature; FirstPublished: 2-Dec-2009; DatasheetVersion: revA, Dec-2008; PackageVersion: revBB, Aug-2009; PackageReference: SOIC-SN8; Publisher: Altium Limited; PackageDescription: 8-Lead Plastic Small Outline (SN) - Narrow, 3.90mm Body [SOIC]; Supplier 1: Digi-Key; Supplier Part Number 1: 25AA02E48-I/SN-ND; Supplier 2: Farnell; Supplier Part Number 2: 1700997; Supplier 3: Newark; Supplier Part Number 3: 45P4904; Code_JEDEC: MS-012; Code_IPC: SOIC127P600-8; ComponentLink1Description: Datasheet; ComponentLink1URL: http://ww1.microchip.com/downloads/en/DeviceDoc/22123A.pdf; ComponentLink2Description: Packaging Specification; ComponentLink2URL: http://www.microchip.com/stellent/groups/techpub_sg/documents/packagingspec/en012702.pdf; ComponentLink3Description: Microchip.com Home; ComponentLink3URL: http://www.microchip.com/
U6 U7 = MAX3232CUE: 3.0V TO 5.5V, Low-Power, up to 1Mbps, True RS-232 Transceiver Using Four 0.1µF External Capacitor; Published: 16-Jan-2001; LatestRevisionDate: 29-May-2009; LatestRevisionNote: IPC-7351 Footprint Added.; DatasheetVersion: Mar-1999; PackageVersion: 21-0066 C; PackageReference: TSSOP16; Publisher: Altium Limited; PackageDescription: 16-Pin Thin Small Outline Package 0.65 mm Pitch; ComponentLink1Description: Manufacturer Link; ComponentLink1URL: http://www.maxim-ic.com/; ComponentLink2Description: Datasheet; ComponentLink2URL: http://pdfserv.maxim-ic.com/en/ds/MAX3222-MAX3241.pdf
U10 = TL430
XT1 XT2 = CRYSTAL